# Altium schematic sheet sar20-baseboard-USB.SchDoc
size A3
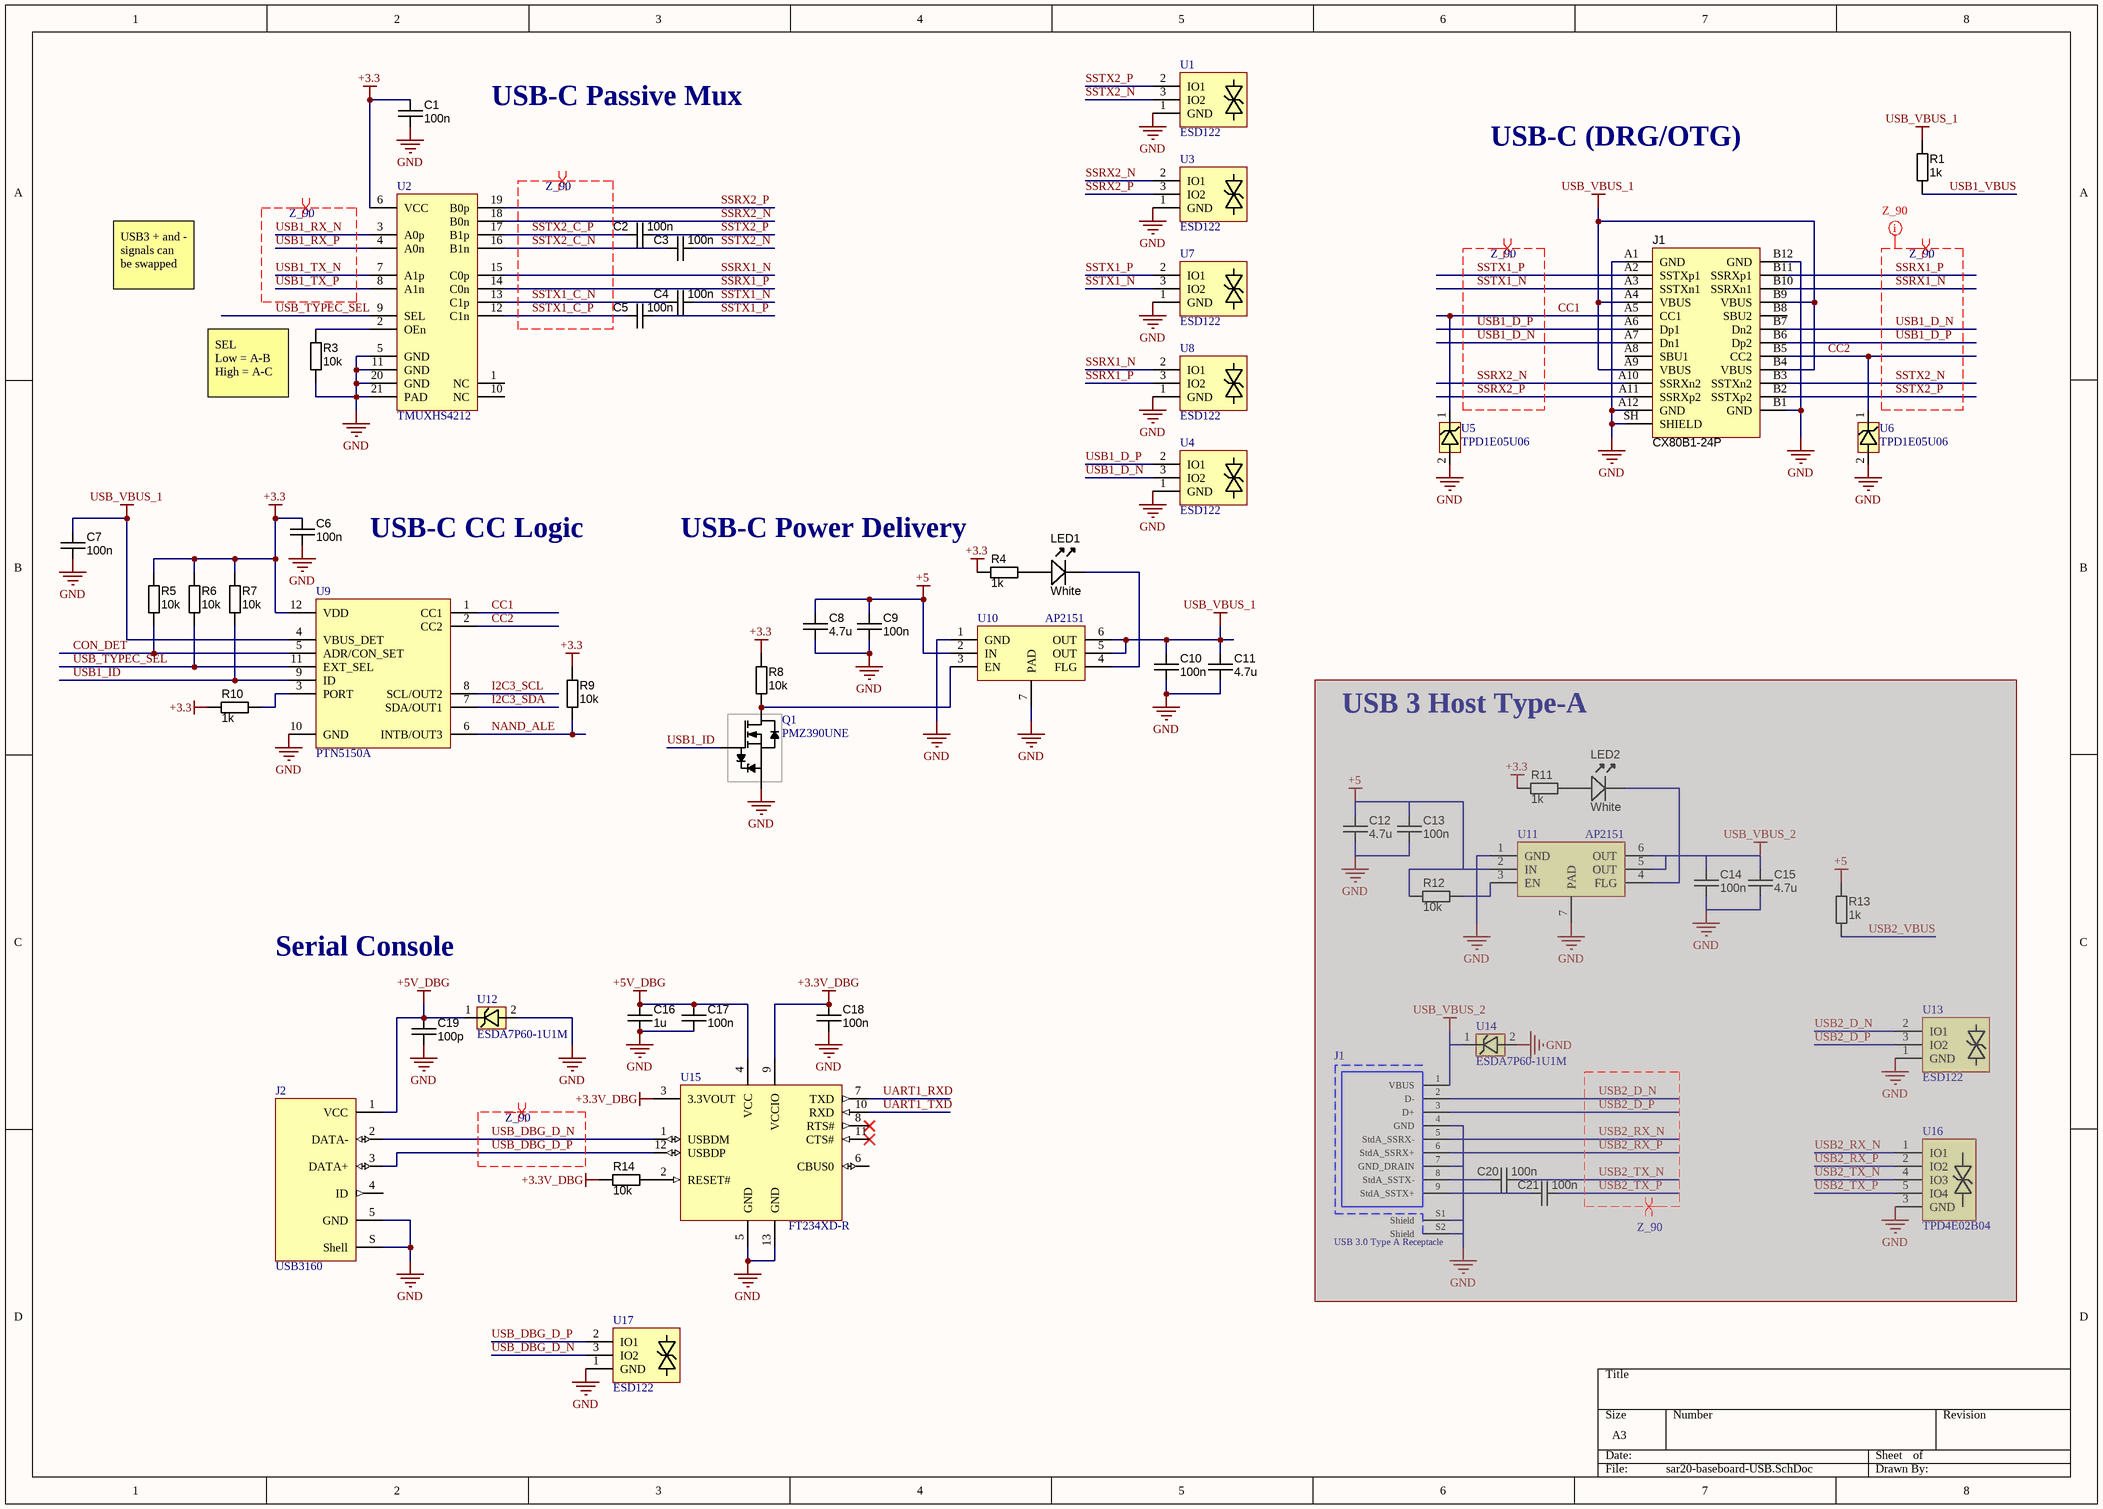
[diagram p0: sar20-baseboard-USB.SchDoc]

## Parts
(Parts that share a designator on the sheet are numbered #1, #2 ... from top to bottom, then left to right.)
C1  value 100n  [CAPC0603X04N]  (hidden comment: CAPC_100n_0201)
C2  value 100n  [CAPC0603X04N]  (hidden comment: CAPC_100n_0201)
C3  value 100n  [CAPC0603X04N]  (hidden comment: CAPC_100n_0201)
C4  value 100n  [CAPC0603X04N]  (hidden comment: CAPC_100n_0201)
C5  value 100n  [CAPC0603X04N]  (hidden comment: CAPC_100n_0201)
C6  100n  [CAPC1005X55N]
C7  100n  [CAPC1005X55N]
C8  value 4.7u  [CAPC1608X90N]  (hidden comment: approved sub OK)
C9  100n  [CAPC1005X55N]
C10  100n  [CAPC1005X55N]
C11  value 4.7u  [CAPC1608X90N]  (hidden comment: approved sub OK)
C12  value 4.7u  [CAPC1608X90N]  (hidden comment: approved sub OK)  (masked out: inside a compile mask, not in the netlist)
C13  100n  [CAPC1005X55N]  (masked out: inside a compile mask, not in the netlist)
C14  100n  [CAPC1005X55N]  (masked out: inside a compile mask, not in the netlist)
C15  value 4.7u  [CAPC1608X90N]  (hidden comment: approved sub OK)  (masked out: inside a compile mask, not in the netlist)
C16  1u  [CAPC1005X55N]
C17  value 100n  [CAPC0603X04N]  (hidden comment: CAPC_100n_0201)
C18  value 100n  [CAPC0603X04N]  (hidden comment: CAPC_100n_0201)
C19  value 100p  [CAPC0603X04N]  (hidden comment: CAPC_100n_0201)
C20  100n  [CAPC1005X55N]  (masked out: inside a compile mask, not in the netlist)
C21  100n  [CAPC1005X55N]  (masked out: inside a compile mask, not in the netlist)
J1#1  CX80B1-24P  [CX80B1-24P]
J1#2  USB 3.0 Type A Receptacle  [692121430000]  (masked out: inside a compile mask, not in the netlist)
J2  USB3160  [USB3160-XX-XXXX-X-X_revA]
LED1  White  [LED-0603-WHITE]
LED2  White  [LED-0603-WHITE]  (masked out: inside a compile mask, not in the netlist)
Q1  PMZ390UNE  [DFN1006-3_SOT883]
R1  value 1k  [RESC1005X40N]  (hidden comment: Thick Film)
R3  value 10k  [RESC1005X40N]  (hidden comment: Thick Film)
R4  value 1k  [RESC1005X40N]  (hidden comment: Thick Film)
R5  value 10k  [RESC1005X40N]  (hidden comment: Thick Film)
R6  value 10k  [RESC1005X40N]  (hidden comment: Thick Film)
R7  value 10k  [RESC1005X40N]  (hidden comment: Thick Film)
R8  value 10k  [RESC1005X40N]  (hidden comment: Thick Film)
R9  value 10k  [RESC1005X40N]  (hidden comment: Thick Film)
R10  value 1k  [RESC1005X40N]  (hidden comment: Thick Film)
R11  value 1k  [RESC1005X40N]  (hidden comment: Thick Film)  (masked out: inside a compile mask, not in the netlist)
R12  value 10k  [RESC1005X40N]  (hidden comment: Thick Film)  (masked out: inside a compile mask, not in the netlist)
R13  value 1k  [RESC1005X40N]  (hidden comment: Thick Film)  (masked out: inside a compile mask, not in the netlist)
R14  value 10k  [RESC0603X03N]  (hidden comment: RESC_0201)
U1  ESD122  [TI_X2SON_DMX0003A]
U2  TMUXHS4212  [TI_VQFN_RKS0020A]
U3  ESD122  [TI_X2SON_DMX0003A]
U4  ESD122  [TI_X2SON_DMX0003A]
U5  TPD1E05U06  [TI_X1SON_DPY]
U6  TPD1E05U06  [TI_X1SON_DPY]
U7  ESD122  [TI_X2SON_DMX0003A]
U8  ESD122  [TI_X2SON_DMX0003A]
U9  PTN5150A  [NXP_X2QFN12_SOT1355-1]
U10  AP2151  [SON50P200X60_HS-7N]
U11  AP2151  [SON50P200X60_HS-7N]  (masked out: inside a compile mask, not in the netlist)
U12  ESDA7P60-1U1M  [DFN105P160X60-2N]
U13  ESD122  [TI_X2SON_DMX0003A]  (masked out: inside a compile mask, not in the netlist)
U14  ESDA7P60-1U1M  [DFN105P160X60-2N]  (masked out: inside a compile mask, not in the netlist)
U15  FT234XD-R  [DFN-12_V]
U16  TPD4E02B04  [TI_USON10_DQA0010A_PASS]  (masked out: inside a compile mask, not in the netlist)
U17  ESD122  [TI_X2SON_DMX0003A]

## Nets
+3.3: C1.2 C6.1 R4.2 R5.2 R6.2 R7.2 R8.2 R9.2 R10.2 U2.6(VCC) U9.12(VDD)
+3.3V_DBG: C18.2 R14.1 U15.3(3.3VOUT) U15.9(VCCIO)
+5: C8.1 C9.1 U10.2(IN)
+5V_DBG: C16.1 C17.2 C19.2 J2.1(VCC) U12.1 U15.4(VCC)
GND: C1.1 C6.2 C7.2 C8.2 C9.2 C10.2 C11.2 C16.2 C17.1 C18.1 C19.1 J1#1.A1(GND) J1#1.A12(GND) J1#1.B1(GND) J1#1.B12(GND) J1#1.SH(SHIELD) J2.5(GND) J2.S(Shell) Q1.2(S) R3.1 U1.1(GND) U2.5(GND) U2.11(GND) U2.20(GND) U2.21(PAD) U3.1(GND) U4.1(GND) U5.2 U6.2 U7.1(GND) U8.1(GND) U9.10(GND) U10.1(GND) U10.7(PAD) U12.2 U15.5(GND) U15.13(GND) U17.1(GND)
USB_VBUS_1: C7.1 C10.1 C11.1 J1#1.A4(VBUS) J1#1.A9(VBUS) J1#1.B4(VBUS) J1#1.B9(VBUS) R1.2 U9.4(VBUS_DET) U10.5(OUT) U10.6(OUT)
CC1: J1#1.A5(CC1) U5.1 U9.1(CC1)
CC2: J1#1.B5(CC2) U6.1 U9.2(CC2)
CON_DET: R5.1 U9.5(ADR/CON_SET)
I2C3_SCL: U9.8(SCL/OUT2)
I2C3_SDA: U9.7(SDA/OUT1)
NAND_ALE: R9.1 U9.6(INTB/OUT3)
SSRX1_N: J1#1.B10(SSRXn1) U2.15(C0p) U8.2(IO1)
SSRX1_P: J1#1.B11(SSRXp1) U2.14(C0n) U8.3(IO2)
SSRX2_N: J1#1.A10(SSRXn2) U2.18(B0n) U3.2(IO1)
SSRX2_P: J1#1.A11(SSRXp2) U2.19(B0p) U3.3(IO2)
SSTX1_C_N: C4.1 U2.13(C1p)
SSTX1_C_P: C5.1 U2.12(C1n)
SSTX1_N: C4.2 J1#1.A3(SSTXn1) U7.3(IO2)
SSTX1_P: C5.2 J1#1.A2(SSTXp1) U7.2(IO1)
SSTX2_C_N: C3.1 U2.16(B1n)
SSTX2_C_P: C2.1 U2.17(B1p)
SSTX2_N: C3.2 J1#1.B3(SSTXn2) U1.3(IO2)
SSTX2_P: C2.2 J1#1.B2(SSTXp2) U1.2(IO1)
UART1_RXD: U15.7(TXD)
UART1_TXD: U15.10(RXD)
USB1_D_N: J1#1.A7(Dn1) J1#1.B7(Dn2) U4.3(IO2)
USB1_D_P: J1#1.A6(Dp1) J1#1.B6(Dp2) U4.2(IO1)
USB1_ID: Q1.1(G) R7.1 U9.9(ID)
USB1_RX_N: U2.3(A0p)
USB1_RX_P: U2.4(A0n)
USB1_TX_N: U2.7(A1p)
USB1_TX_P: U2.8(A1n)
USB1_VBUS: R1.1
USB_DBG_D_N: J2.2(DATA-) U15.1(USBDM) U17.3(IO2)
USB_DBG_D_P: J2.3(DATA+) U15.12(USBDP) U17.2(IO1)
USB_TYPEC_SEL: R6.1 U2.9(SEL) U9.11(EXT_SEL)
NetLED1_A: LED1.A R4.1
NetLED1_K: LED1.K U10.4(FLG)
NetQ1_3: Q1.3(D) R8.1 U10.3(EN)
NetR3_2: R3.2 U2.2(OEn)
NetR10_1: R10.1 U9.3(PORT)
NetR14_2: R14.2 U15.2(RESET#)

Not connected (* = marked no-connect by the designer): J1#1 A8(SBU1) B8(SBU2); J2 4(ID); U2 1(NC) 10(NC); U15 6(CBUS0) 8(RTS#)* 11(CTS#)*

## Layout directives
differential pair; differential pair class Z_90: SSRX1_N, SSRX1_P, SSRX2_N, SSRX2_P, SSTX1_C_N, SSTX1_C_P, SSTX1_N, SSTX1_P, SSTX2_C_N, SSTX2_C_P, SSTX2_N, SSTX2_P, USB1_D_N, USB1_D_P, USB1_RX_N, USB1_RX_P, USB1_TX_N, USB1_TX_P, USB2_D_N, USB2_D_P, USB2_RX_N, USB2_RX_P, USB2_TX_N, USB2_TX_P, USB_DBG_D_N, USB_DBG_D_P
net class Z_90: SSRX1_N, SSRX1_P, SSTX2_N, SSTX2_P, USB1_D_N, USB1_D_P

## Notes on the sheet
- USB-C Passive Mux
- USB-C (DRG/OTG)
- USB3 + and - signals can be swapped
- (near R3) SEL
  Low = A-B
  High = A-C
- USB-C CC Logic
- (near R4) USB-C Power Delivery
- USB 3 Host Type-A
- Serial Console

## Library data of the parts
C6 C7 C9 C10 C13 C14 C20 C21 = CAPC_100n_0402_X5R_16V_10%: Capacitor SMD Cer 100nF 10% 16V X5R 0402; Manufacturer 1: AVX Corporation; Manufacturer Part Number 1: 0402YD104KAT2A; Ratings: 16V; X5R; SCDType: spec; Tolerance: ±10%; Operating Temperature: -55°C ~ 125°C; Package / Case: 0402 (1005 Metric); Size / Dimension: 0.039" L x 0.020" W (1.00mm x 0.50mm); Supplier 1: Digi-Key; Supplier Part Number 1: 478-1126-1-ND; ComponentLink1URL: http://www.avx.com/docs/Catalogs/cx5r.pdf; ComponentLink1Description: http://www.avx.com/docs/Catalogs/cx5r.pdf; Supplier 2: Digi-Key; Supplier Part Number 2: 311-1347-1-ND; Manufacturer 2: Yageo; Manufacturer Part Number 2: CC0402KRX5R7BB104; ComponentLink2URL: http://www.yageo.com/documents/recent/UPY-GPHC_X5R_4V-to-50V_12.pdf; ComponentLink2Description: http://www.yageo.com/documents/recent/UPY-GPHC_X5R_4V-to-50V_12.pdf; Value: 100n
C8 C11 C12 C15 = CAPC_2u2_0603_10V_10%: Capacitor SMD Cer 2.2uF 10% 10V X5R 0603; Manufacturer 1: AVX Corporation; Manufacturer Part Number 1: 0603ZD225KAT2A; Ratings: 10V; X5R; Material: ceramic; SCDType: spec; Package / Case: 0603 (1608 metric); Tolerance: ±10%; Supplier 1: Digi-Key; Supplier Part Number 1: 478-6212-1-ND; ComponentLink1URL: http://www.avx.com/docs/Catalogs/cx5r.pdf; ComponentLink1Description: http://www.avx.com/docs/Catalogs/cx5r.pdf
C16 = CAPC_1u_0402_X5R_6V3_10%: Capacitor SMD Cer 1uF 10% 16V X5R 0402; Manufacturer 1: AVX Corporation; Manufacturer Part Number 1: 04026D105KAT2A; Ratings: 6.3V; X5R; SCDType: spec; Tolerance: ±10%; Operating Temperature: -55°C ~ 125°C; Package / Case: 0402 (1005 Metric); Size / Dimension: 0.039" L x 0.020" W (1.00mm x 0.50mm); Supplier 1: Digi-Key; Supplier Part Number 1: 478-2583-1-ND; RoHS 1: RoHS Compliant; ComponentLink1URL: http://www.avx.com/docs/Catalogs/cx5r.pdf; ComponentLink1Description: http://www.avx.com/docs/Catalogs/cx5r.pdf; Supplier 2: Digi-Key; Supplier Part Number 2: 311-1438-1-ND; Manufacturer 2: Yageo; Manufacturer Part Number 2: CC0402KRX5R5BB105; RoHS 2: RoHS Compliant; ComponentLink2URL: http://www.yageo.com/documents/recent/UPY-GPHC_X5R_4V-to-50V_12.pdf; ComponentLink2Description: http://www.yageo.com/documents/recent/UPY-GPHC_X5R_4V-to-50V_12.pdf; Supplier 3: Digi-Key; Supplier Part Number 3: 1276-1010-1-ND; Manufacturer 3: Samsung Electro-Mechanics America, Inc; Manufacturer Part Number 3: CL05A105KQ5NNNC; RoHS 3: RoHS Compliant; ComponentLink3URL: http://www.samsungsem.com/servlet/FileDownload?path=productsearch&sname=CL05A105KQ5NNNC.pdf&oname=CL05A105KQ5NNNC.pdf; ComponentLink3Description: http://www.samsungsem.com/servlet/FileDownload?path=productsearch&sname=CL05A105KQ5NNNC.pdf&oname=CL05A105KQ5NNNC.pdf; Supplier 4: Digi-Key; Supplier Part Number 4: 445-4998-1-ND; Manufacturer 4: TDK Corporation; Manufacturer Part Number 4: C1005X5R0J105K050BB; RoHS 4: RoHS Compliant; ComponentLink4URL: http://product.tdk.com/capacitor/mlcc/en/documents/mlcc_commercial_general_en.pdf; ComponentLink4Description: http://product.tdk.com/capacitor/mlcc/en/documents/mlcc_commercial_general_en.pdf; Supplier 5: Digi-Key; Supplier Part Number 5: 490-1320-1-ND; Manufacturer 5: Murata Electronics North America; Manufacturer Part Number 5: GRM155R60J105KE19D; RoHS 5: RoHS Compliant; ComponentLink5URL: http://www.murata.com/products/catalog/pdf/c02e.pdf; ComponentLink5Description: http://www.murata.com/products/catalog/pdf/c02e.pdf; Value: 1u
J1#2 = 692121430000: USB 3.0 Type A, Receptacle, Vertical, THT; Manufacturer: Wurth Elektronik; Rated Current: 1.8A; Pin Number: 9; Interface Type: Type A; Working Voltage: 30VAC; ComponentLink1Description: Manufacturer; ComponentLink1URL: http://www.we-online.de; ComponentLink2Description: Datasheet; ComponentLink2URL: https://katalog.we-online.com/em/datasheet/692121430000.pdf; Published Date: September 2019; Manufacturer Part Number: 692121430000; Gender: Receptacle; Type: Vertical; Packaging: Tray; Operating Temperature: -20 to +85degC; Mounting Technology: THT; Application: USB 3.0
J2 = USB3160-XX-XXXX-X-X_revA: Micro USB Receptacle, Type B, SMT, Vertical, with Locating Peg, with Through-Hole Shell Stakes
LED1 LED2 = LED_SMD_White_0603_Bright: LED 0603 SMD Bright White 8700K; Manufacturer 1: Lite-On Inc; Manufacturer Part Number 1: LTW-C193TS5; Material: InGaN; Ratings: Ultra Bright; 8700K; Millicandela Rating: 230mcd; Voltage - Forward (Vf) Typ: 3.3V; Viewing Angle: 120°; Lens Type: Clear, Tinted; Lens Style/Size: Rectangle with Flat Top, 0.8mm x 1.1mm; Voltage - Forward (Vf) @ 10mA: 3.0V; SCDType: source; Package / Case: 0603 (1608 metric); Supplier 1: Digi-Key; Supplier Part Number 1: 160-1721-1-ND; Supplier 2: Digi-Key; Supplier Part Number 2: APT1608QWF/D-ND; Manufacturer 2: Kingbright Corp; Manufacturer Part Number 2: APT1608QWF/D; Color: White; Size / Dimension: 1.60mm L x 0.80mm W; Mounting Type: Surface Mount; Luminous Flux @ Current - Test: -; ComponentLink2URL: http://www.kingbrightusa.com/images/catalog/SPEC/APT1608QWF-D.pdf; ComponentLink2Description: http://www.kingbrightusa.com/images/catalog/SPEC/APT1608QWF-D.pdf; ComponentLink1URL: http://media.digikey.com/pdf/Data%20Sheets/Lite-On%20PDFs/LTW-C193TS5.pdf; ComponentLink1Description: http://media.digikey.com/pdf/Data%20Sheets/Lite-On%20PDFs/LTW-C193TS5.pdf
R1 R3-R13 = RES_10K_0402_1%: Resistor SMD chip 10k Ohm 0.063W 1% 0402; Manufacturer 1: Vishay Dale; Manufacturer Part Number 1: CRCW040210K0FKED; Ratings: 1/16 W; SCDType: spec; Package / Case: 0402 (1005 Metric); Manufacturer 2: Yageo; Manufacturer Part Number 2: RC0402FR-0710KL; Supplier 1: Digi-Key; Supplier Part Number 1: 541-10.0KLCT-ND; ComponentLink1URL: http://www.vishay.com/doc?20035; ComponentLink1Description: http://www.vishay.com/doc?20035; Supplier 2: Digi-Key; Supplier Part Number 2: 311-10.0KLRCT-ND; ComponentLink2URL: http://www.yageo.com/documents/recent/PYu-RC0402_51_RoHS_L_6.pdf; ComponentLink2Description: http://www.yageo.com/documents/recent/PYu-RC0402_51_RoHS_L_6.pdf; Tolerance: ±1%
U10 U11 = AP2151_DFN: USB optimized power switch by Diodes Inc
U15 = FT234XD-R: FT234XD USB to BASIC UART IC, -40 to +85 degC, 12-Pin DFN, Pb-Free, Tape and Reel; Manufacturer: FTDI; DatasheetVersion: ver 1.1, Feb-2013; PackageVersion: Feb-13; PackageReference: DFN-12; PackageDescription: 12-Pin Dual Flat No-Lead, 3 x 3 mm Body, 0.45 mm Pitch, Exposed Pad; PartNumber: FT234XD-R; ComponentLink1Description: Manufacturer URL; ComponentLink1URL: http://www.ftdichip.com/; ComponentLink2Description: Datasheet; ComponentLink2URL: http://www.ftdichip.com/Support/Documents/DataSheets/ICs/DS_FT234XD.pdf